# Altium schematic sheet Rookie Task - ELEC - PCB.SchDoc
size A4; SheetNumber: 1; SheetTotal: 2
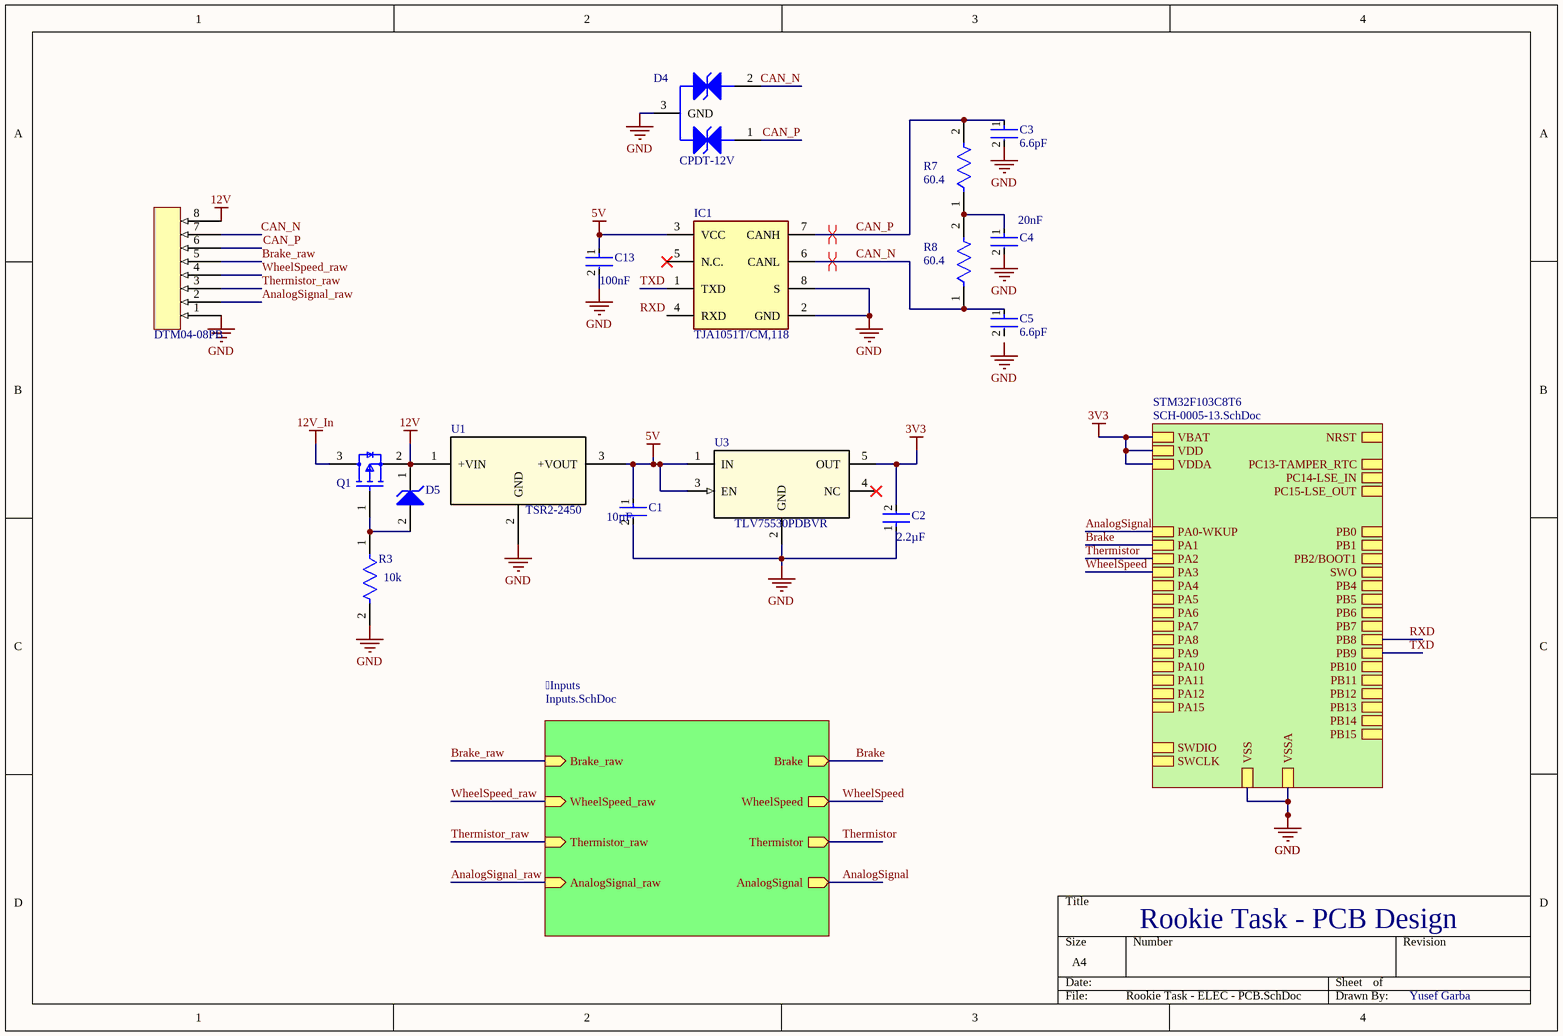
[diagram p0: Rookie Task - ELEC - PCB.SchDoc]

## Parts
C1  value 10µF  [FP-GRM21B-0_2-e0_2_0_7-IPC_A]  (hidden comment: GRM21BR61H106KE43K)
C2  value 2.2µF  [FP-CL21-IPC_A]  (hidden comment: CL21A225KBFNNNE)
C3  value 6.6pF  [FP-CBR06C-MFG]  (hidden comment: CBR06C669B5GAC)
C4  value 20nF  [FP-CL21-IPC_A]  (hidden comment: 08055C203KAT2A)
C5  value 6.6pF  [FP-CBR06C-MFG]  (hidden comment: CBR06C669B5GAC)
C13  value 100nF  [FP-CL21-IPC_A]  (hidden comment: CL21B104KBCNNNC)
D4  CPDT-12V  [SOT95P240X115-3M]
D5  SZMMSZ15T1G  [ONSC-SOD-123-2-425-04_V]  (value not drawn)
IC1  TJA1051T/CM,118  [SOIC127P600X175-8N]
J?  DTM04-08PB
Q1  DMP3056L-7  [FP-SOT23-IPC_A]  (value not drawn)
R3  value 10k  [FP-RMCF0805-IPC_A]  (hidden comment: RMCF0805FT10K0)
R7  value 60.4  [FP-RMCF0805-IPC_A]  (hidden comment: RMCF0805FT60R4)
R8  value 60.4  [FP-RMCF0805-IPC_A]  (hidden comment: RMCF0805FT60R4)
U1  TSR2-2450  [TSR 2-2450_TRP]
U3  TLV75530PDBVR  [DBV0005A_M]

## Sub-sheets
Inputs = Inputs.SchDoc: Brake_raw (in), WheelSpeed_raw (in), Brake (out), WheelSpeed (out), Thermistor (out), AnalogSignal (out), Thermistor_raw (in), AnalogSignal_raw (in)
STM32F103C8T6 = SCH-0005-13.SchDoc: VBAT, VDDA, VSSA, VSS, VDD, PB2/BOOT1, PA0-WKUP, PC14-LSE_IN, PC15-LSE_OUT, NRST, PC13-TAMPER_RTC, PA1, PA2, PA3, PA4, PA5, PA6, PA7, PA8, PA9, PA10, PA11, PA12, PA15, PB15, PB14, PB13, PB12, PB11, PB10, PB9, PB8, PB7, PB6, PB5, PB4, PB1, PB0, SWDIO, SWCLK, SWO

## Nets
3V3: C2.2 U3.5(OUT) ; sheet STM32F103C8T6/VBAT, sheet STM32F103C8T6/VDDA, sheet STM32F103C8T6/VDD
5V: C1.1 C13.1 IC1.3(VCC) U1.3(+VOUT) U3.1(IN) U3.3(EN)
12V: D5.1(K) J?.8 Q1.2(S) U1.1(+VIN)
12V_In: Q1.3(D)
GND: C1.2 C2.1 C3.2 C4.2 C13.2 D4.3(GND) IC1.2(GND) IC1.8(S) J?.1 R3.2 U1.2(GND) U3.2(GND) ; sheet STM32F103C8T6/VSSA, sheet STM32F103C8T6/VSS
AnalogSignal: sheet Inputs/AnalogSignal, sheet STM32F103C8T6/PA0-WKUP
AnalogSignal_raw: J?.2 ; sheet Inputs/AnalogSignal_raw
Brake: sheet Inputs/Brake, sheet STM32F103C8T6/PA1
Brake_raw: J?.5 ; sheet Inputs/Brake_raw
CAN_N: C5.1 D4.2(IN2) IC1.6(CANL) R8.1
CAN_P: C3.1 D4.1(IN1) IC1.7(CANH) R7.2
RXD: sheet STM32F103C8T6/PB8
Thermistor: sheet Inputs/Thermistor, sheet STM32F103C8T6/PA2
Thermistor_raw: J?.3 ; sheet Inputs/Thermistor_raw
TXD: IC1.1(TXD) ; sheet STM32F103C8T6/PB9
WheelSpeed: sheet Inputs/WheelSpeed, sheet STM32F103C8T6/PA3
WheelSpeed_raw: J?.4 ; sheet Inputs/WheelSpeed_raw
NetC4_1: C4.1 R7.1 R8.2
NetD5_2: D5.2(A) Q1.1(G) R3.1

Not connected (* = marked no-connect by the designer): C5 2; IC1 4(RXD) 5(N.C.)*; J? 6 7; U3 4(NC)*

## Layout directives
differential pair: CAN_N, CAN_P

## Notes on the sheet
- Rookie Task - PCB Design
- Yusef Garba
- Labels drawn without touching a wire or pin: CAN_N, CAN_P, GND, RXD

## Library data of the parts
C1 = CMP-001-00091-4: Ceramic Capacitor, Ceramic, 50V, 10uF, Surface Mount, 0805; Voltage Rating: 50V
C2 = CMP-001-00092-2: Ceramic Capacitor, Multilayer, Ceramic, 50V, 10% +Tol, 10% -Tol, X5R, 15% TC, 2.2uF, Surface Mount, 0805; Multilayer: Yes; Rated DC Voltage (URdc): 50V; Tolerance  (fill in as +-): 10%; Tolerance (fill in as +-): 10%; Dielectric Material: Ceramic; Min Operating Temperature: -55°C; Max Operating Temperature: 85°C; Reach SVHC Compliant: Yes; Packaging: Tape and Reel; Length: 2mm; Termination: Wraparound; Temperature Characteristics Code: X5R; Capacitor Type: Ceramic; Pins: 2; Width: 1.25mm; Case/Package: 0805; Mounting Technology: Surface Mount; Package Style: SMTMeter; RoHS Compliant: Yes; Package Shape: Rectangular; JESD-609 Code: e3; Height: 1.25mm; Terminal Finish: Nickel
C3 C5 = CMP-001-00094-3: Ceramic Capacitor, Multilayer, Ceramic, 50V, 1.5152% +Tol, 1.5152% -Tol, C0G, -/+30ppm/Cel TC, 0.0000066uF, Surface Mount, 0603; Multilayer: Yes; Tolerance (fill in as +-): 1.5152%; Dielectric Material: Ceramic; Reach SVHC Compliant: Yes; Tolerance  (fill in as +-): 1.5152%; RoHS Compliant: Yes; Width: 0.8mm; Packaging: Tape and Reel; Pins: 2; Temperature Characteristics Code: C0G; Length: 1.6mm; Terminal Finish: Tin; Package Style: SMTMeter; JESD-609 Code: e3; Rated DC Voltage (URdc): 50V; Case/Package: 0603; Min Operating Temperature: -55°C; Height: 0.8mm; Max Operating Temperature: 125°C; Capacitor Type: Ceramic
C4 = CMP-001-00009-2: Ceramic Capacitor, Multilayer, Ceramic, 50V, 10% +Tol, 10% -Tol, X7R, 15% TC, 0.02uF, Surface Mount, 0805; RoHS Compliant: Yes; Min Operating Temperature: -55°C; Capacitor Type: Ceramic; Max Operating Temperature: 125°C
C13 = CMP-001-00087-3: Ceramic Capacitor, Multilayer, Ceramic, 50V, 10% +Tol, 10% -Tol, X7R, 15% TC, 0.1uF, Surface Mount, 0805; Multilayer: Yes; Height: 0.95mm; Max Operating Temperature: 125°C; Case/Package: 0805; Rated DC Voltage (URdc): 50V; Packaging: Tape and Reel; Reach SVHC Compliant: Yes; Capacitor Type: Ceramic; Temperature Characteristics Code: X7R; Width: 1.25mm; Length: 2mm; Tolerance  (fill in as +-): 10%; Tolerance (fill in as +-): 10%; Package Shape: Rectangular; Dielectric Material: Ceramic; Package Style: SMTMeter; Mounting Technology: Surface Mount; Pins: 2; JESD-609 Code: e3; Termination: Wraparound; Min Operating Temperature: -55°C; RoHS Compliant: Yes; Terminal Finish: Nickel
D4 = CMP-00033-2: Trans Voltage Suppressor Diode, 25W, 12V V(RWM), Bidirectional, 2 Element, Silicon; Clamping Voltage-Max: 25V; Breakdown Voltage-Nom: 17V; JESD-609 Code: e4; RoHS Compliant: Yes; Terminal Finish: Gold; Polarity: Bidirectional; Surface Mount: Yes; Diode Type: TRANS VOLTAGE SUPPRESSOR; Reach SVHC Compliant: Yes
D5 = CMP-004-00009-2: Zener Diode, 15V V(Z), 5%, 0.5W, Silicon, Unidirectional; Max Operating Temperature: 150°C; Min Operating Temperature: -55°C; Forward Voltage: 15V; RoHS Compliant: Yes; Pins: 2
IC1 = CMP-015-00001-2: Interface Circuit, 1-Trnsvr, PDSO8; RoHS Compliant: Yes
J? = CMP-00145-2: 8-pin Deutsch connector, female.; Connector Type: Receptacle; Polarized: Yes; Connector System: Wire-to-Wire; Hybrid Connector: No; Sealable: Yes (With); Strain Relief: Add By Accessory; Number of Positions: 8; Pitch: 4mm; Housing Color: Grey; RoHS Compliant: Yes; Number of Rows: 2; Length: 1.72inch; Mounting Technology: Free Hanging; Min Operating Temperature: -55°C; Fastening Type: Latch; Packaging: Bulk; Housing Material: Thermoplastic; Width: 1.245inch; Color: Black; Max Operating Temperature: 125°C; Series: DTM; Contact Type: Male Pin; ELV: Compliant; Serviceable: Yes; Height: 0.796inch; Termination: Crimp
Q1 = CMP-013-00035-3: Power Field-Effect Transistor, 4.3A I(D), 30V, 0.05ohm, 1-Element, P-Channel, Silicon, Metal-oxide Semiconductor FET; Number of Elements: 1; Drain-source On Resistance-Max: 50mR; Transistor Application: SWITCHING; Package Body Material: Plastic; Pulsed Drain Current-Max (IDM): 20A; Operating Mode: ENHANCEMENT MODE; Package Style: SMALL OUTLINEMeter; Package Shape: Rectangular; JESD-609 Code: e3; RoHS Compliant: Yes; JESD-30 Code: R-PDSO-G3; Polarity/Channel Type: P-CHANNEL; Terminal Form: Gull Wing; Transistor Element Material: SILICON; Reach SVHC Compliant: Yes; Terminal Position: DUAL; Moisture Sensitivity Level: 1; FET Technology: METAL-OXIDE SEMICONDUCTOR; DS Breakdown Voltage-Min: 30V; Surface Mount: Yes; Terminal Finish: Tin; Pins: 3; Drain Current-Max (ID): 4.3A
R3 = CMP-009-00334-2: Fixed Resistor, Metal Glaze/thick Film, 0.125W, 10000ohm, 150V, 1% +/-Tol, 100ppm/Cel, Surface Mount, 0805; Package Length: 2mm; Package Width: 1.25mm; Reference Standard: AEC-Q200; Temperature Coefficient: 100ppm/°C; Package Height: 0.5mm; Rated Temperature: 70°C; Power: 125mW; Mounting Technology: Surface Mount; Construction: Rectangular; Terminal Finish: Nickel; JESD-609 Code: e3; Technology: METAL GLAZE/THICK FILM; Resistor Type: FIXED RESISTOR; Max Operating Temperature: 155°C; Min Operating Temperature: -55°C; RoHS Compliant: Yes; Package Style: SMTMeter; Reach SVHC Compliant: Yes; Packaging: Tape and Reel; Case/Package: 0805; Tolerance: 1%; Package Shape: Rectangular; Working Voltage: 150V; Pins: 2; Termination: Wraparound
R7 R8 = CMP-009-00185-2: Fixed Resistor, Metal Glaze/thick Film, 0.125W, 60.4ohm, 150V, 1% +/-Tol, 100ppm/Cel, Surface Mount, 0805; RoHS Compliant: Yes; Max Operating Temperature: 155°C; Case/Package: 0805; Min Operating Temperature: -55°C; Tolerance: 1%
U1 = CMP-019-00053-3: DC-DC Regulated Power Supply Module, 1 Output, 10W, Hybrid; Max Supply Voltage: 36V; Min Operating Temperature: -40°C; RoHS Compliant: Yes; Pins: 3; Max Operating Temperature: 67°C
U3 = CMP-103-000000-3: No Description Available; Mfr_Name: Texas Instruments; Design Item ID: TLV75530PDBVR; Copyright: Copyright (C) 2024 Ultra Librarian. All rights reserved.; Type: DEV; RoHS Compliant: Yes; Source: TLV75530PDBVR.SchLib; Manufacturer_Part_Number: TLV75530PDBVR; RefDes: RefDes